# Altium schematic sheet IC3.SchDoc
size A4; Engineer: Altium Designer; Organization: PXL; SheetNumber: 1; SheetTotal: 7
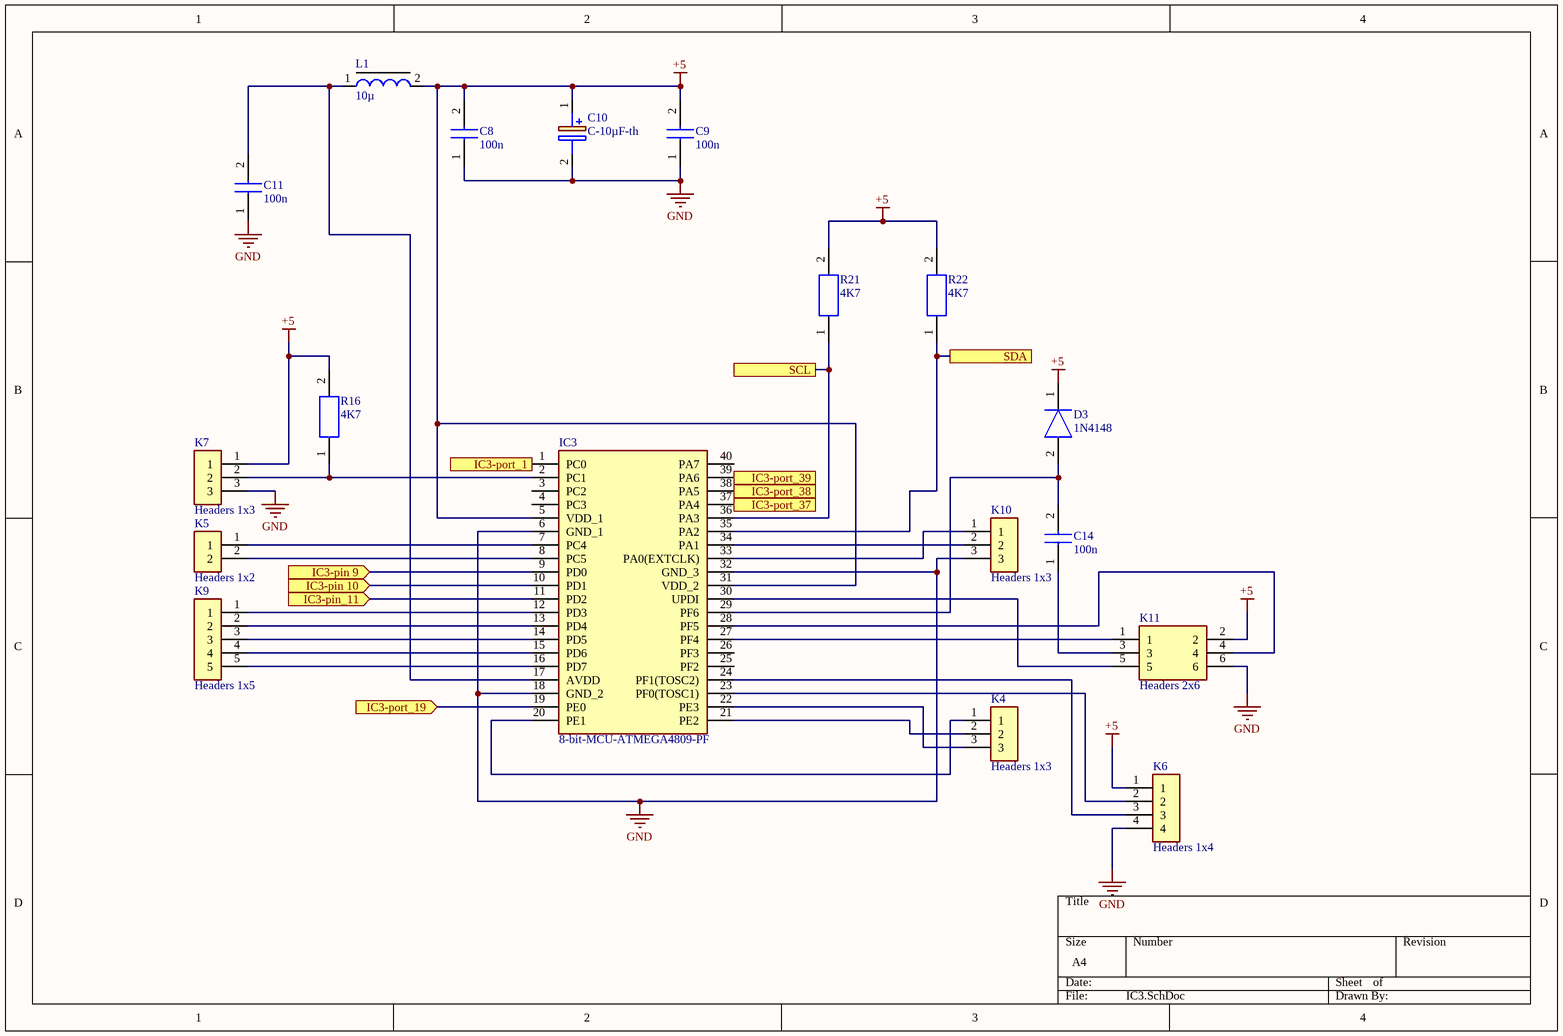
[diagram p0: IC3.SchDoc]

## Parts
C8  100n  [C-0805-smd]
C9  100n  [C-0805-smd]
C10  C-10µF-th  [C-10µF-th]
C11  100n  [C-0805-smd]
C14  100n  [C-0805-smd]
D3  1N4148  [1N4148]
IC3  8-bit-MCU-ATMEGA4809-PF  [8-bit-MCU-ATMEGA4809-PF]
K4  Headers 1x3  [Headers 1x3]
K5  Headers 1x2  [Headers 1x2]
K6  Headers 1x4  [Headers 1x4]
K7  Headers 1x3  [Headers 1x3]
K9  Headers 1x5  [Headers 1x5]
K10  Headers 1x3  [Headers 1x3]
K11  Headers 2x6  [Headers 2x6]
L1  10µ  [Smorespoel-10µH-130mA]
R16  4K7  [R-0805]
R21  4K7  [R-0805]
R22  4K7  [R-0805]

## Ports
IC3-pin 9 (in), IC3-pin 10 (in), IC3-pin_11 (in), IC3-port_1, IC3-port_19 (in), IC3-port_37, IC3-port_38, IC3-port_39, SCL, SDA

## Nets
+5: C8.2 C9.2 C10.1(+) D3.1(K) IC3.5(VDD_1) IC3.31(VDD_2) K6.1 K7.1 K11.2 L1.2 R16.2 R21.2 R22.2
GND: C8.1 C9.1 C10.2(-) C11.1 IC3.6(GND_1) IC3.18(GND_2) IC3.32(GND_3) K6.4 K7.3 K10.3 K11.6
IC3-pin 9: IC3.9(PD0) ; port IC3-pin 9
IC3-pin 10: IC3.10(PD1) ; port IC3-pin 10
IC3-pin_11: IC3.11(PD2) ; port IC3-pin_11
IC3-port_1: IC3.1(PC0) ; port IC3-port_1
IC3-port_19: IC3.19(PE0) ; port IC3-port_19
IC3-port_37: IC3.37(PA4) ; port IC3-port_37
IC3-port_38: IC3.38(PA5) ; port IC3-port_38
IC3-port_39: IC3.39(PA6) ; port IC3-port_39
SCL: IC3.36(PA3) R21.1 ; port SCL
SDA: IC3.35(PA2) R22.1 ; port SDA
NetC11_2: C11.2 IC3.17(AVDD) L1.1
NetC14_1: C14.1 K11.3
NetC14_2: C14.2 D3.2(A) IC3.29(PF6)
NetIC3_2: IC3.2(PC1) K7.2 R16.1
NetIC3_7: IC3.7(PC4) K5.1
NetIC3_8: IC3.8(PC5) K5.2
NetIC3_12: IC3.12(PD3) K9.1
NetIC3_13: IC3.13(PD4) K9.2
NetIC3_14: IC3.14(PD5) K9.3
NetIC3_15: IC3.15(PD6) K9.4
NetIC3_16: IC3.16(PD7) K9.5
NetIC3_20: IC3.20(PE1) K4.1
NetIC3_21: IC3.21(PE2) K4.2
NetIC3_22: IC3.22(PE3) K4.3
NetIC3_23: IC3.23(PF0(TOSC1)) K6.2
NetIC3_24: IC3.24(PF1(TOSC2)) K6.3
NetIC3_27: IC3.27(PF4) K11.1
NetIC3_28: IC3.28(PF5) K11.4
NetIC3_30: IC3.30(UPDI) K11.5
NetIC3_33: IC3.33(PA0(EXTCLK)) K10.1
NetIC3_34: IC3.34(PA1) K10.2

Not connected (* = marked no-connect by the designer): IC3 3(PC2) 4(PC3) 25(PF2) 26(PF3) 40(PA7)

## Library data of the parts
C8 C9 C11 C14 = C-0805-smd: Capacitor; Manufacturer_Name: Kemet; Manufacturer_Part_Number: C0805C301G5GACTU; Datasheet Link: https://connect.kemet.com:7667/gateway/IntelliData-ComponentDocumentation/1.0/download/specsheet/C0805C301G5GACTU; Height: 0.88mm
C10 = C-10µF-th: Capacitor Polarised; Manufacturer_Name: Panasonic; Manufacturer_Part_Number: ECA-1HM100I; Datasheet Link: https://componentsearchengine.com//ECA-1HM100I.pdf; Height: 12mm; Mouser2 Part Number: 667-ECA-1HM100I; Mouser2 Price/Stock: https://www.mouser.com/Search/Refine.aspx?Keyword=667-ECA-1HM100I
D3 = 1N4148: Diode; Manufacturer_Name: Nexperia; Datasheet Link: https://datasheet.datasheetarchive.com/originals/distributors/Datasheets-112/DSAP0040891.pdf; Manufacturer_Part_Number: 1N4148
IC3 = 8-bit-MCU-ATMEGA4809-PF: Integrated Circuit; Manufacturer_Name: Microchip; Datasheet Link: https://componentsearchengine.com//ATMEGA4809-PF.pdf; Height: 6.35mm; Mouser2 Part Number: 556-ATMEGA4809-PF; Mouser2 Price/Stock: https://www.mouser.com/Search/Refine.aspx?Keyword=556-ATMEGA4809-PF; Manufacturer_Part_Number: ATMEGA4809-PF
K4 K7 K10 = Headers 1x3: Connector; Manufacturer_Name: TE Connectivity; Manufacturer_Part_Number: 2-826646-0; Datasheet Link: https://componentsearchengine.com/Datasheets/1/2-826646-0.pdf; Height: 8.8mm
K5 = Headers 1x2: Connector; Manufacturer_Name: TE Connectivity; Manufacturer_Part_Number: 2-826646-0; Datasheet Link: https://componentsearchengine.com/Datasheets/1/2-826646-0.pdf; Height: 8.8mm
K6 = Headers 1x4: Connector; Manufacturer_Name: TE Connectivity; Manufacturer_Part_Number: 2-826646-0; Datasheet Link: https://componentsearchengine.com/Datasheets/1/2-826646-0.pdf; Height: 8.8mm
K9 = Headers 1x5: Connector; Manufacturer_Name: TE Connectivity; Manufacturer_Part_Number: 2-826646-0; Datasheet Link: https://componentsearchengine.com/Datasheets/1/2-826646-0.pdf; Height: 8.8mm
K11 = Headers 2x6: Connector; Manufacturer_Name: Harwin; Manufacturer_Part_Number: M20-9761042; Datasheet Link: https://componentsearchengine.com//M20-9761042.pdf; Height: 8.38mm; Mouser2 Part Number: 855-M20-9761042; Mouser2 Price/Stock: https://www.mouser.com/Search/Refine.aspx?Keyword=855-M20-9761042
L1 = Smorespoel-10µH-130mA: THT Common Mode Power Line Choke WE-CMB, L = 1.00 mH; Inductance: 1.00 mH; PackageDescription: THT Inductor, 4-Leads, Body 27.5 x 18.5 mm; PackageReference: WE-CMB-L; PackageVersion: 2004; ComponentLink2URL: http://www.we-online.de/katalog/media/pdf/744824101.pdf; ComponentLink2Description: Datasheet; ComponentLink1Description: Manufacturer Link; DatasheetVersion: ver 5, Oct-2004; ComponentLink1URL: http://www.we-online.com
R16 R21 R22 = R-0805: Resistor; Manufacturer_Name: Vishay; Manufacturer_Part_Number: TNPU0805500RAZEN00; Height: 0.55mm